# Altium schematic sheet Schematic1.SchDoc
size A4
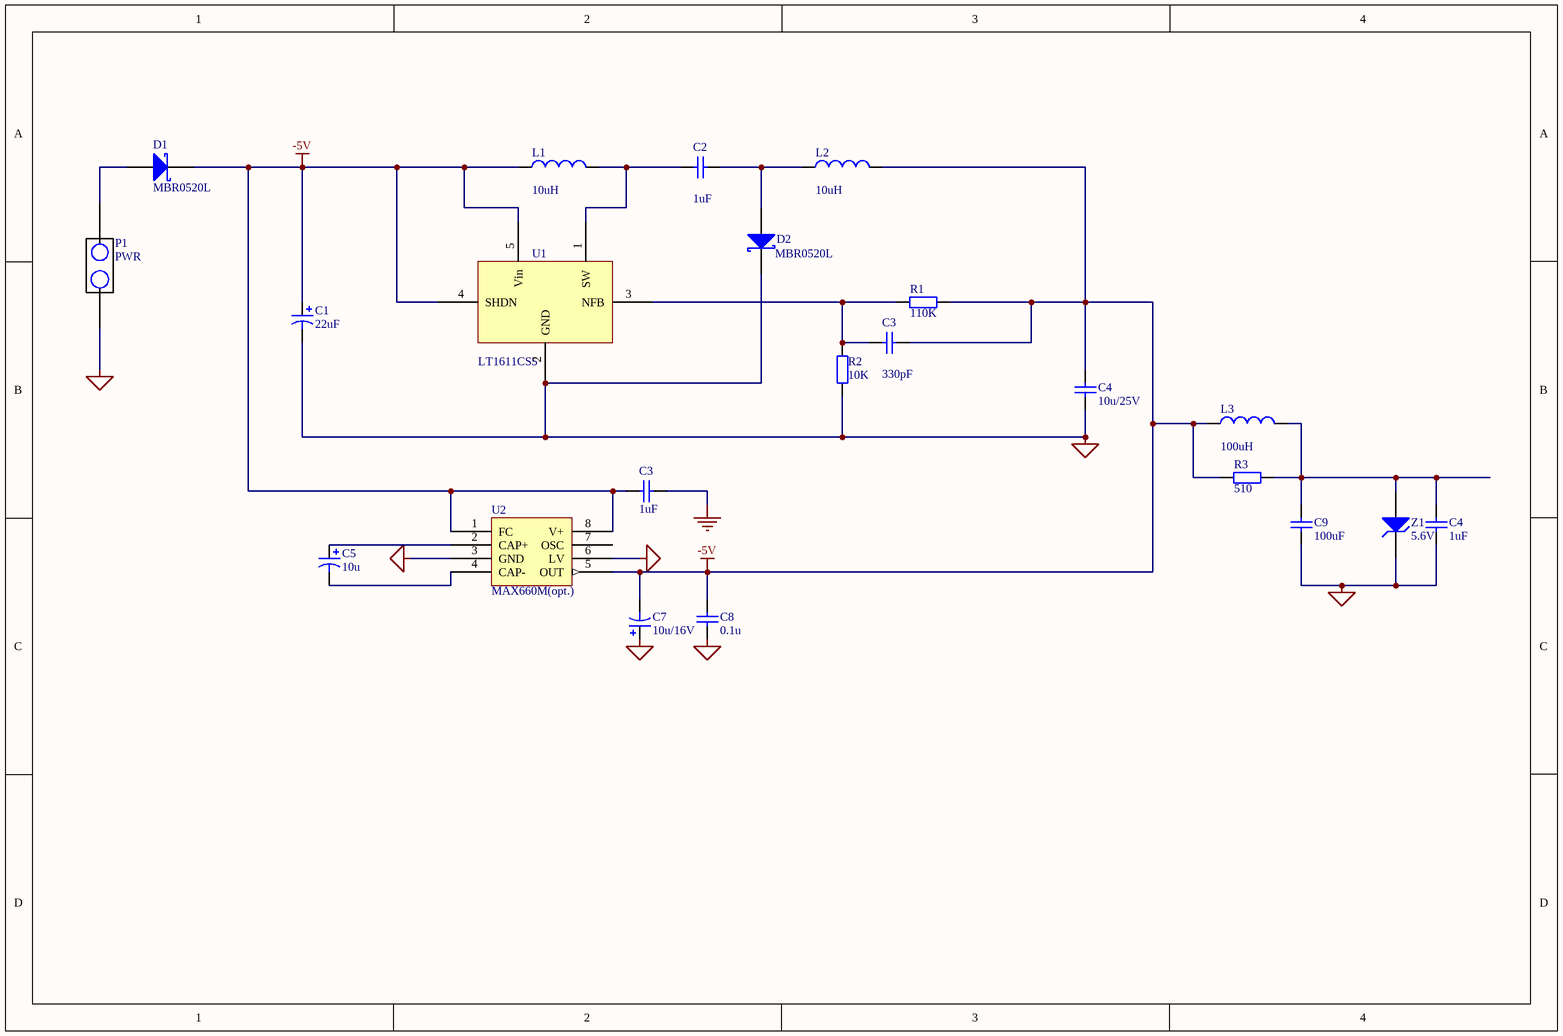
[diagram p0: Schematic1.SchDoc]

## Parts
(Parts that share a designator on the sheet are numbered #1, #2 ... from top to bottom, then left to right.)
C1  value 22uF  [C0805]  (hidden comment: Cap Pol3)
C2  value 1uF  [RAD-0.3]  (hidden comment: Cap)
C3#1  value 330pF  [RAD-0.3]  (hidden comment: Cap)
C3#2  value 1uF  [RAD-0.3]  (hidden comment: Cap)
C4#1  value 10u/25V  [RAD-0.3]  (hidden comment: Cap)
C4#2  value 1uF  [RAD-0.3]  (hidden comment: Cap)
C5  value 10u  [C0805]  (hidden comment: Cap Pol3)
C7  value 10u/16V  [C0805]  (hidden comment: Cap Pol3)
C8  value 0.1u  [RAD-0.3]  (hidden comment: Cap)
C9  value 100uF  [RAD-0.3]  (hidden comment: Cap)
D1  MBR0520L  [SOT-23_N]
D2  MBR0520L  [SOT-23_N]
L1  value 10uH  [0402-A]  (hidden comment: Inductor)
L2  value 10uH  [0402-A]  (hidden comment: Inductor)
L3  value 100uH  [0402-A]  (hidden comment: Inductor)
P1  PWR  [RAD-0.1]
R1  value 110K  [AXIAL-0.4]  (hidden comment: Res2)
R2  value 10K  [AXIAL-0.4]  (hidden comment: Res2)
R3  value 510  [AXIAL-0.4]  (hidden comment: Res2)
U1  LT1611CS5  [SOT23-5]
U2  MAX660M(opt.)  [SO-8]
Z1  5.6V  [DIODE-0.7]

## Nets
-5V: C1.1 C3#1.2 C3#2.1 C4#1.2 C7.2 C8.2 D1.3(K) L1.1 L2.2 L3.1 R1.1 R3.2 U1.4(SHDN) U1.5(Vin) U2.1(FC) U2.5(OUT) U2.8(V+)
GND: C1.2 C3#2.2 C4#1.1 C4#2.1 C7.1 C8.1 C9.1 D2.3(K) P1.4(I) R2.1 U1.2(GND) U2.3(GND) U2.6(LV) Z1.2(K)
NetC2_1: C2.1 L1.2 U1.1(SW)
NetC2_2: C2.2 D2.1(A) L2.1
NetC3#1_1: C3#1.1 R1.2 R2.2 U1.3(NFB)
NetC4#2_2: C4#2.2 C9.2 L3.2 R3.1 Z1.1(A)
NetC5_1: C5.1 U2.2(CAP+)
NetC5_2: C5.2 U2.4(CAP-)
NetD1_1: D1.1(A) P1.3(I)

Not connected (* = marked no-connect by the designer): U2 7(OSC)

## Library data of the parts
C1 C5 C7 = Cap Pol3: Polarized Capacitor (Surface Mount); Published: 8-Jun-2000; LatestRevisionDate: 29-May-2009; LatestRevisionNote: IPC-7351 Footprint Added.; PackageReference: C0805; Publisher: Altium Limited; PackageDescription: Chip Capacitor
C2 C3#1 C3#2 C4#1 C4#2 C8 C9 = Cap: Capacitor; Published: 8-Jun-2000; LatestRevisionDate: 17-Jul-2002; LatestRevisionNote: Re-released for DXP Platform.; PackageReference: RAD-0.3; Publisher: Altium Limited; PackageDescription: Radial Cap, Thru-Hole; 2 Leads; 0.3 in Pin Spacing
D1 D2 = Diode BAT17: Silicon RF Schottky Diode for Mixer Applications in the VHF/UHF Range; Note: Pin 2 is not connected and not drawn.; Published: 21-Mar-2003; LatestRevisionDate: 29-May-2009; LatestRevisionNote: IPC-7351 Footprint Added.; DatasheetVersion: Oct-1999; PackageVersion: Sep-2001; PackageReference: SOT-23; Publisher: Altium Limited; PackageDescription: 3-Pin SOT-23 Package 0.95 mm Pitch, 2.5 mm Lead Span; ComponentLink1Description: Manufacturer Link; ComponentLink1URL: http://www.infineon.com/; ComponentLink2Description: Datasheet; ComponentLink2URL: http://www.infineon.com/upload/Document/cmc_upload/documents/009/363/bat17series.pdf
L1-L3 = Inductor: Code_IEC: 1005; Published: 8-Jun-2000; LatestRevisionDate: 29-May-2009; LatestRevisionNote: IPC-7351 Footprint Added.; PackageReference: 0402-A; Publisher: Altium Limited; PackageDescription: Chip Inductor; Code_JEITA: 0402
R1-R3 = Res2: Resistor; Published: 8-Jun-2000; LatestRevisionDate: 17-Jul-2002; LatestRevisionNote: Re-released for DXP Platform.; PackageReference: AXIAL-0.4; Publisher: Altium Limited; PackageDescription: Axial Device, Thru-Hole; 2 Leads; 0.4 in Pin Spacing
Z1 = D Zener: Zener Diode; Published: 8-Jun-2000; LatestRevisionDate: 17-Jul-2002; LatestRevisionNote: Re-released for DXP Platform.; PackageReference: DIODE-0.7; Publisher: Altium Limited; PackageDescription: Diode, Thru-Hole; 2 Leads; 0.7 in Pin Spacing